# EAGLE design Pro_Shield_1 (EAGLE 7.1.0)
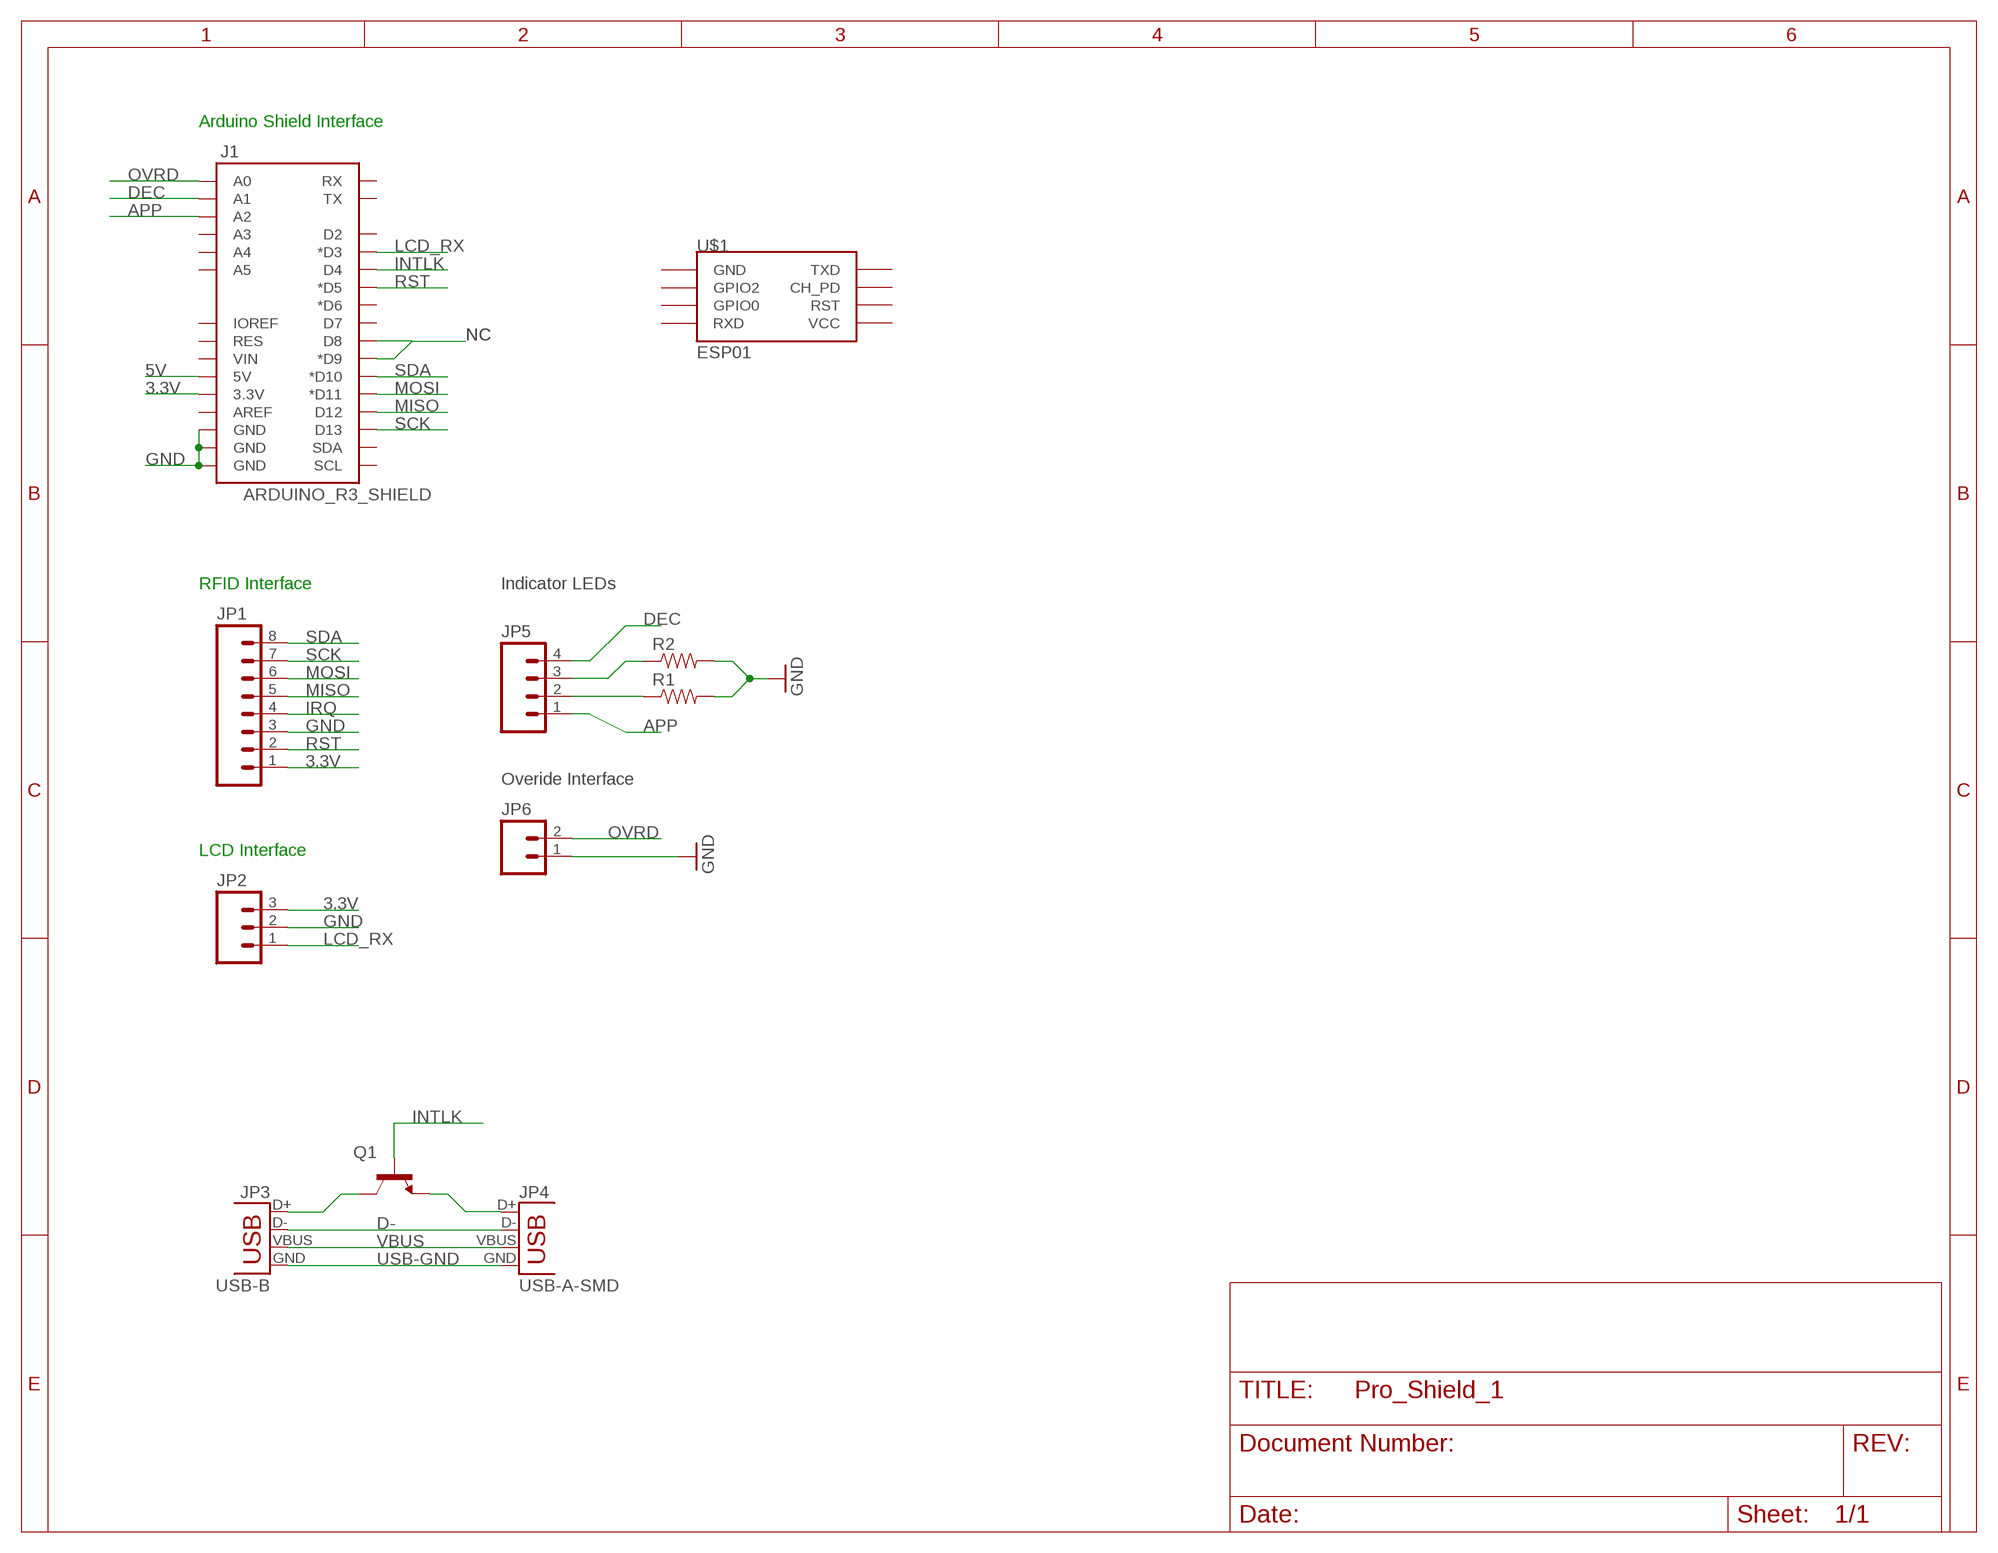
[diagram p0: schematic, sheet 1]

## Parts
J1  ARDUINO_R3_SHIELD  [UNO_R3_SHIELD]
JP1  M08LONGPADS  [1X08_LONGPADS]
JP2  M03LONGPADS  [1X03_LONGPADS]
JP3  USB-B  USBPTH  [USB-B-PTH]
JP4  USB-A-SMD  [USB-A-S-NOSILK-FEMALE]
JP5  M04LONGPADS  [1X04_LONGPADS]
JP6  M02LOCK_LONGPADS  [1X02_LOCK_LONGPADS]
Q1  TRANSISTOR_NPNBC547  [TO-92-AMMO]
R1  RESISTORPTH-1/4W  [AXIAL-0.4]
R2  RESISTORPTH-1/4W  [AXIAL-0.4]
U$1  ESP01  [ESP01]

## Nets
3.3V: J1.3.3V JP1.1 JP2.3
5V: J1.5V
APP: J1.A2 JP5.1
D-: JP3.D- JP4.D-
DEC: J1.A1 JP5.4
GND: J1.GND@0(GND) J1.GND@1(GND) J1.GND@2(GND) JP1.3 JP2.2 JP6.1 R1.P$2 R2.P$2
INTLK: J1.D4 Q1.2(B)
IRQ: JP1.4
LCD_RX: J1.D3(*D3) JP2.1
MISO: J1.D12 JP1.5
MOSI: J1.D11(*D11) JP1.6
N$1: J1.D8 J1.D9(*D9)
N$4: JP3.D+ Q1.1(C)
N$5: JP4.D+ Q1.3(E)
N$6: JP5.2 R1.P$1
N$7: JP5.3 R2.P$1
OVRD: J1.A0 JP6.2
RST: J1.D5(*D5) JP1.2
SCK: J1.D13 JP1.7
SDA: J1.D10(*D10) JP1.8
USB-GND: JP3.GND JP4.GND
VBUS: JP3.VBUS JP4.VBUS
Unconnected: J1.A3 J1.A4 J1.A5 J1.AREF J1.D2 J1.D6(*D6) J1.D7 J1.IOREF J1.RES J1.RX J1.SCL J1.SDA J1.TX J1.VIN U$1.CH_PD U$1.GND U$1.GPIO0 U$1.GPIO2 U$1.RST U$1.RX(RXD) U$1.TX(TXD) U$1.VCC

## Notes on the sheet
- Arduino Shield Interface
- NC | NC
- RFID Interface | Indicator LEDs
- Overide Interface
- LCD Interface

## Library data of the parts
J1 = SparkFun-Boards:ARDUINO_R3_SHIELD: Shield form compatible with the Arduino Uno R3.
JP1 = SparkFun-Connectors:M08: Header 8 Standard 8-pin 0.1" header. Use with straight break away headers (SKU : PRT-00116), right angle break away headers (PRT-00553), swiss pins (PRT-00743), machine pins (PRT-00117), and female headers (PRT-00115).
JP2 = SparkFun-Connectors:M03: Header 3 Standard 3-pin 0.1" header. Use with straight break away headers (SKU : PRT-00116), right angle break away headers (PRT-00553), swiss pins (PRT-00743), machine pins (PRT-00117), and female headers (PRT-00115). Molex polarized connector foot print use with SKU : PRT-08232 with associated crimp pins and housings.
JP3 = SparkFun-Connectors:USB: USB Connectors USB-B-PTH is fully proven SKU : PRT-00139/CONN-08278 USB-miniB is fully proven SKU : PRT-00587 USB-A-PCB is untested. USB-A-H is throughly reviewed, but untested. Spark Fun Electronics SKU : PRT-00437 USB-B-SMT is throughly reviewed, but untested. Needs silkscreen touching up. USB-A-S has not been used/tested USB-MB-H has not been used/tested USB-MICROB has been used. CONN-09505; PROD_ID: CONN-08278
JP4 = SparkFun-Connectors:USB: USB Connectors USB-B-PTH is fully proven SKU : PRT-00139/CONN-08278 USB-miniB is fully proven SKU : PRT-00587 USB-A-PCB is untested. USB-A-H is throughly reviewed, but untested. Spark Fun Electronics SKU : PRT-00437 USB-B-SMT is throughly reviewed, but untested. Needs silkscreen touching up. USB-A-S has not been used/tested USB-MB-H has not been used/tested USB-MICROB has been used. CONN-09505; PROD_ID: CONN-09520
JP5 = SparkFun-Connectors:M04: Header 4 Standard 4-pin 0.1" header. Use with straight break away headers (SKU : PRT-00116), right angle break away headers (PRT-00553), swiss pins (PRT-00743), machine pins (PRT-00117), and female headers (PRT-00115). Molex polarized connector foot print use with SKU : PRT-08231 with associated crimp pins and housings. 1MM SMD Version SKU: PRT-10208
JP6 = SparkFun-Connectors:M02: Standard 2-pin 0.1" header. Use with - straight break away headers ( PRT-00116) - right angle break away headers (PRT-00553) - swiss pins (PRT-00743) - machine pins (PRT-00117) - female headers (PRT-00115) Molex polarized connector foot print use with: PRT-08233 with associated crimp pins and housings. 2.54_SCREWTERM for use with PRT-10571. 3.5mm Screw Terminal footprints for PRT-08084 5mm Screw Terminal footprints for use with PRT-08432
Q1 = SparkFun-DiscreteSemi:TRANSISTOR_NPN: Generic NPN BJT MMBT2222A - TRANS-08049 (SOT-23, 1A 40V) MPSA42 - TRANS-09116 (SOT-23, 500mA 300V) MMBT5088LT1G - TRANS-11160 (SOT-23, 50 mA 30V) BC547 - COM-08928 <http://www.sparkfun.com/products/8928> (TO-92 45V 100mA) (1.Collector 2.Base 3.Emitter) 2N3904 - COM-00521 <http://www.sparkfun.com/products/521> (TO-92 40V 200mA) (1.Emitter 2.Base 3.Collector) P2N2222A - COM-12852 <http://www.sparkfun.com/products/12852> (TO-92 40V 600mA) (1.Collector 2.Base 3.Emitter)
R1 R2 = SparkFun-Resistors:RESISTOR: Resistor Basic schematic elements and footprints for 0603, 1206, and PTH resistors.
U$1 = esp8266modules:ESP01: ESP8266 Wifi module 01

## Board
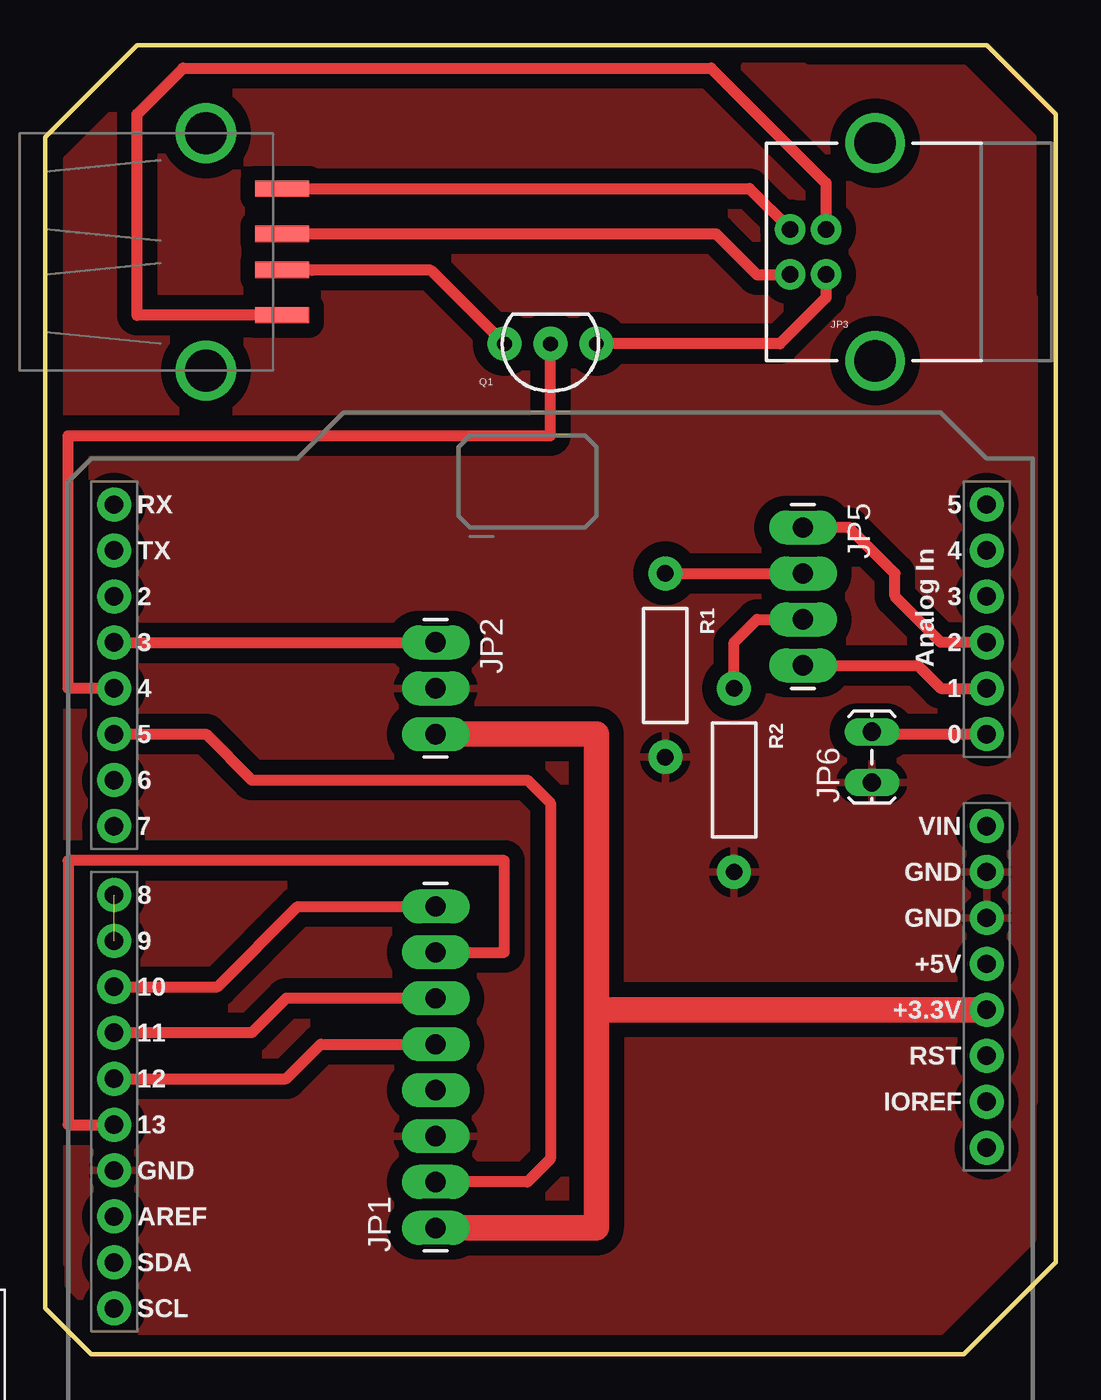
[diagram p1: board, top side]

Size 55.88 x 72.39 mm. Coordinates in mm from the lower left corner, seen from the top.
Outline: 0,2.54 2.54,0 50.8,0 55.88,5.08 55.88,68.58 52.07,72.39 5.08,72.39 0,67.31 0,2.54
Copper layers (1*16): Top 0.035mm / dielectric 1.5mm / Bottom 0.035mm
Design rules "default *": minimum track width 24mil, minimum drill 24mil, track to track 32mil, track to pad 32mil, pad to pad 16mil, via to via 16mil, smd to smd 16mil, copper to edge 24mil, drill to drill 8mil, minimum pad ring 10mil, minimum via ring 8mil, stop-mask expansion 4mil, vias tented up to drill 0mil, thermal gap 18mil

### Footprints (pad centres in the part's own frame; a part is rotated, then mirrored left to right if it is on the bottom)
UNO_R3_SHIELD = drill 1.016 pad 1.88: 3.3V 50.8,26.67; 5V 50.8,29.21; A0 50.8,41.91; A1 50.8,44.45; A2 50.8,46.99; A3 50.8,49.53; A4 50.8,52.07; A5 50.8,54.61; AREF 2.54,15.24; D2 2.54,49.53; D3 2.54,46.99; D4 2.54,44.45; D5 2.54,41.91; D6 2.54,39.37; D7 2.54,36.83; D8 2.54,33.02; D9 2.54,30.48; D10 2.54,27.94; D11 2.54,25.4; D12 2.54,22.86; D13 2.54,20.32; GND@0 50.8,31.75; GND@1 50.8,34.29; GND@2 2.54,17.78; IOREF 50.8,21.59; NC 50.8,19.05; RES 50.8,24.13; RX 2.54,54.61; SCL 2.54,10.16; SDA 2.54,12.7; TX 2.54,52.07; VIN 50.8,36.83
1X08_LONGPADS = drill 1.118 pad 1.88 long: 1 0,0; 2 2.54,0; 3 5.08,0; 4 7.62,0; 5 10.16,0; 6 12.7,0; 7 15.24,0; 8 17.78,0
1X03_LONGPADS = drill 1.118 pad 1.88 long: 1 0,0; 2 2.54,0; 3 5.08,0
USB-B-PTH = drill 0.914 pad 1.676: D+ 0,1.25; D- 1.981,1.25; GND 0,-1.25; VBUS 1.981,-1.25 | drill 2.286: S1 -2.718,-6.02; S2 -2.718,6.02
USB-A-S-NOSILK-FEMALE = smd 3 x 0.9: D+ 4.212,-1; D- 4.212,1; GND 4.212,-3.5; VBUS 4.212,3.5 | drill 2.311: S1 0,-6.566; S2 0,6.566
1X04_LONGPADS = drill 1.118 pad 1.88 long: 1 0,0; 2 2.54,0; 3 5.08,0; 4 7.62,0
1X02_LOCK_LONGPADS = drill 1.016 long: 1 -0.127,0; 2 2.667,0
TO-92-AMMO = drill 0.813 pad 1.88: 1 -2.54,0; 2 0,0; 3 2.54,0
AXIAL-0.4 = drill 0.9 pad 1.88: P$1 -5.08,0; P$2 5.08,0
ESP01 = drill 0.8: CH_PD -1.285,-8.178; GPIO0 1.255,-5.638; GPIO2 -1.285,-5.638; RST 1.255,-8.178; TX -3.825,-8.178; VCC 3.795,-8.178 | drill 0.8 square: GND -3.825,-5.638; RX 3.795,-5.638

### Placement (x,y rotation side)
J1  1.27,-7.62 0 top
JP1  21.59,6.99 90 top
JP2  21.59,39.37 270 top
JP3  43.18,60.96 180 top
JP4  8.89,60.96 0 top
JP5  41.91,45.72 270 top
JP6  45.72,31.75 90 top
Q1  27.94,55.88 180 top
R1  34.29,38.1 270 top
R2  38.1,31.75 270 top
U$1  -9.53,-11.43 0 top  (outside the outline)

### Tracks (layer width: path | path; a pad name or v marks a point on that pad's centre or on a via)
3.3V
  Top 1.422: J1.3.3V 30.48,19.05 | 30.48,19.05 30.48,6.99 JP1.1 | 30.48,19.05 30.48,34.29 JP2.3
APP
  Top 0.61: J1.A2 49.53,39.37 46.99,41.91 46.99,43.18 44.45,45.72 JP5.1
D-
  Top 0.61: JP4.D- 37.1,61.96 39.37,59.69 41.18,59.69 JP3.D-
DEC
  Top 0.61: JP5.4 48.26,38.1 49.53,36.83 J1.A1
GND
  pour Top: 54.61,6.35 49.53,1.27 3.81,1.27 1.27,3.81 1.27,66.04 6.35,71.12 50.8,71.12 54.61,67.31
INTLK
  Top 0.61: J1.D4 1.27,36.83 1.27,50.8 27.94,50.8 Q1.2
LCD_RX
  Top 0.61: J1.D3 4.12,39.32 21.18,39.32 JP2.1
MISO
  Top 0.61: J1.D12 13.33,15.24 15.24,17.14 JP1.5
MOSI
  Top 0.61: JP1.6 13.33,19.68 11.43,17.78 J1.D11
N$1  (1 unrouted)
N$2
  pour Top: 1.27,5.08 45.72,5.08 54.61,13.97 54.61,58.42 41.91,71.12 6.35,71.12 1.27,66.04
N$4
  Top 0.61: JP3.D+ 43.18,58.42 40.64,55.88 Q1.1
N$5
  Top 0.61: JP4.D+ 14.78,59.94 21.34,59.94 Q1.3
N$6
  Top 0.61: R1.P$1 JP5.2
N$7
  Top 0.61: R2.P$1 38.1,39.37 39.37,40.64 JP5.3
OVRD
  Top 0.61: JP6.2 45.85,34.29 J1.A0
RST
  Top 0.61: J1.D5 8.89,34.29 11.43,31.75 26.67,31.75 27.94,30.48 27.94,10.79 26.67,9.52 JP1.2
SCK
  Top 0.61: JP1.7 25.4,22.22 25.4,27.3 1.27,27.3 1.27,12.7 J1.D13
SDA
  Top 0.61: J1.D10 9.53,20.32 13.97,24.76 JP1.8
USB-GND
  Top 0.61: JP4.GND 5.08,57.46 5.08,68.58 7.62,71.12 36.83,71.12 43.18,64.77 JP3.GND
VBUS
  Top 0.61: JP4.VBUS 38.95,64.46 JP3.VBUS